# Altium project sar19-main-board.PrjPcb
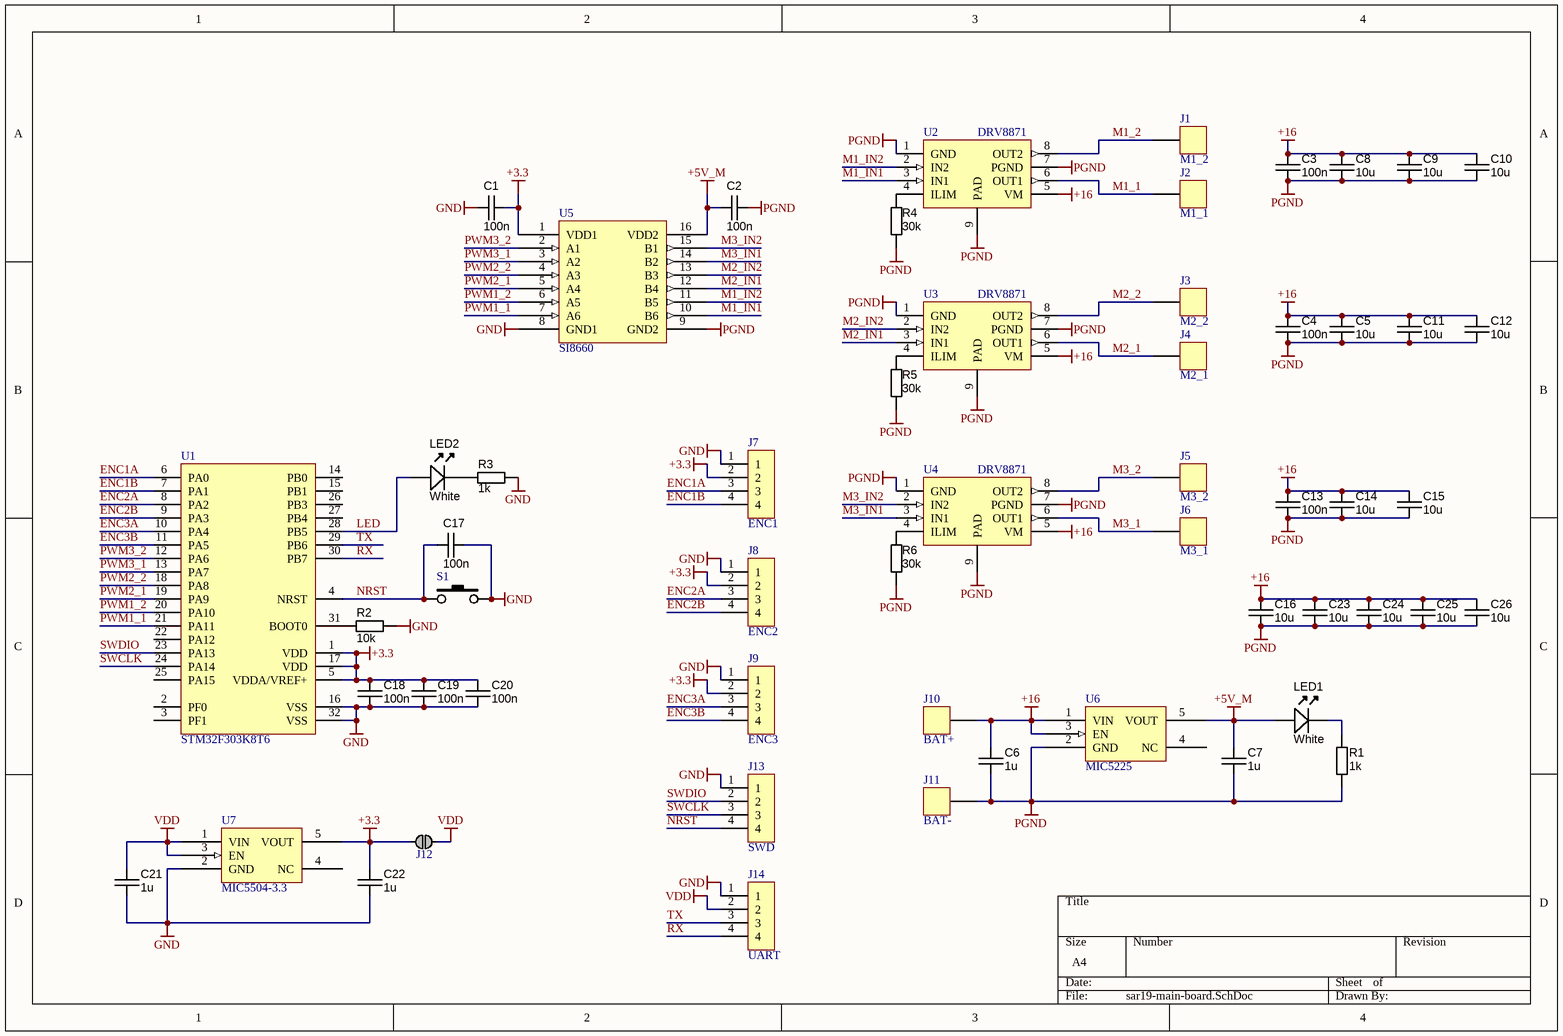
[diagram p0: sar19-main-board.SchDoc]
1 sheet, 56 parts. Net scope: global (net labels, ports and power ports of the same name join across sheets).
Board file: sar19-main-board.PcbDoc

## Sheet sar19-main-board.SchDoc
size A4

### Parts
C1  value 100n  [CAPC1608X90N]  (hidden comment: approved sub OK)
C2  value 100n  [CAPC1608X90N]  (hidden comment: approved sub OK)
C3  value 100n  [CAPC1608X90N]  (hidden comment: approved sub OK)
C4  value 100n  [CAPC1608X90N]  (hidden comment: approved sub OK)
C5  10u  [CAPC3216X180N]
C6  value 1u  [CAPC1608X90N]  (hidden comment: approved sub OK)
C7  value 1u  [CAPC1608X90N]  (hidden comment: approved sub OK)
C8  10u  [CAPC3216X180N]
C9  10u  [CAPC3216X180N]
C10  10u  [CAPC3216X180N]
C11  10u  [CAPC3216X180N]
C12  10u  [CAPC3216X180N]
C13  value 100n  [CAPC1608X90N]  (hidden comment: approved sub OK)
C14  10u  [CAPC3216X180N]
C15  10u  [CAPC3216X180N]
C16  10u  [CAPC3216X180N]
C17  value 100n  [CAPC1608X90N]  (hidden comment: approved sub OK)
C18  value 100n  [CAPC1608X90N]  (hidden comment: approved sub OK)
C19  value 100n  [CAPC1608X90N]  (hidden comment: approved sub OK)
C20  value 100n  [CAPC1608X90N]  (hidden comment: approved sub OK)
C21  value 1u  [CAPC1608X90N]  (hidden comment: approved sub OK)
C22  value 1u  [CAPC1608X90N]  (hidden comment: approved sub OK)
C23  10u  [CAPC3216X180N]
C24  10u  [CAPC3216X180N]
C25  10u  [CAPC3216X180N]
C26  10u  [CAPC3216X180N]
J1  M1_2  [POWER-PAD-4x3]
J2  M1_1  [POWER-PAD-4x3]
J3  M2_2  [POWER-PAD-4x3]
J4  M2_1  [POWER-PAD-4x3]
J5  M3_2  [POWER-PAD-4x3]
J6  M3_1  [POWER-PAD-4x3]
J7  ENC1  [MICRO-MATCH-FOB-04]
J8  ENC2  [MICRO-MATCH-FOB-04]
J9  ENC3  [MICRO-MATCH-FOB-04]
J10  BAT+  [POWER-PAD-4x3]
J11  BAT-  [POWER-PAD-4x3]
J12  JUMPER  [JUMPER-SMD-1010]  (value not drawn)
J13  SWD  [MICRO-MATCH-FOB-04]
J14  UART  [MICRO-MATCH-FOB-04]
LED1  White  [LED-0603-GREEN]
LED2  White  [LED-0603-GREEN]
R1  1k  [RESC1608X55N]
R2  10k  [RESC1608X55N]
R3  1k  [RESC1608X55N]
R4  30k  [RESC1608X55N]
R5  30k  [RESC1608X55N]
R6  30k  [RESC1608X55N]
S1  PUSHBUTTON  [KMR421NGLFS]  (value not drawn)
U1  STM32F303K8T6  [LQFP32]
U2  DRV8871  [HSOP8]
U3  DRV8871  [HSOP8]
U4  DRV8871  [HSOP8]
U5  SI8660  [QSOP16]
U6  MIC5225  [SOT23-5]
U7  MIC5504-3.3  [SOT23-5]

### Nets
+3.3: C1.1 C18.1 C19.1 C20.1 C22.1 J7.2 J8.2 J9.2 J12.1 U1.1(VDD) U1.5(VDDA/VREF+) U1.17(VDD) U5.1(VDD1) U7.5(VOUT)
+5V_M: C2.1 C7.1 LED1.A U5.16(VDD2) U6.5(VOUT)
+16: C3.1 C4.1 C5.1 C6.1 C8.1 C9.1 C10.1 C11.1 C12.1 C13.1 C14.1 C15.1 C16.1 C23.1 C24.1 C25.1 C26.1 J10.1 U2.5(VM) U3.5(VM) U4.5(VM) U6.1(VIN) U6.3(EN)
GND: C1.2 C17.1 C18.2 C19.2 C20.2 C21.2 C22.2 J7.1 J8.1 J9.1 J13.1 J14.1 R2.2 R3.2 S1.2 U1.16(VSS) U1.32(VSS) U5.8(GND1) U7.2(GND)
PGND: C2.2 C3.2 C4.2 C5.2 C6.2 C7.2 C8.2 C9.2 C10.2 C11.2 C12.2 C13.2 C14.2 C15.2 C16.2 C23.2 C24.2 C25.2 C26.2 J11.1 R1.2 R4.2 R5.2 R6.2 U2.1(GND) U2.7(PGND) U2.9(PAD) U3.1(GND) U3.7(PGND) U3.9(PAD) U4.1(GND) U4.7(PGND) U4.9(PAD) U5.9(GND2) U6.2(GND)
VDD: C21.1 J12.2 J14.2 U7.1(VIN) U7.3(EN)
ENC1A: J7.3 U1.6(PA0)
ENC1B: J7.4 U1.7(PA1)
ENC2A: J8.3 U1.8(PA2)
ENC2B: J8.4 U1.9(PA3)
ENC3A: J9.3 U1.10(PA4)
ENC3B: J9.4 U1.11(PA5)
LED: LED2.A U1.28(PB5)
M1_1: J2.1 U2.6(OUT1)
M1_2: J1.1 U2.8(OUT2)
M1_IN1: U2.3(IN1) U5.10(B6)
M1_IN2: U2.2(IN2) U5.11(B5)
M2_1: J4.1 U3.6(OUT1)
M2_2: J3.1 U3.8(OUT2)
M2_IN1: U3.3(IN1) U5.12(B4)
M2_IN2: U3.2(IN2) U5.13(B3)
M3_1: J6.1 U4.6(OUT1)
M3_2: J5.1 U4.8(OUT2)
M3_IN1: U4.3(IN1) U5.14(B2)
M3_IN2: U4.2(IN2) U5.15(B1)
NRST: C17.2 J13.4 S1.1 U1.4(NRST)
PWM1_1: U1.21(PA11) U5.7(A6)
PWM1_2: U1.20(PA10) U5.6(A5)
PWM2_1: U1.19(PA9) U5.5(A4)
PWM2_2: U1.18(PA8) U5.4(A3)
PWM3_1: U1.13(PA7) U5.3(A2)
PWM3_2: U1.12(PA6) U5.2(A1)
RX: J14.4 U1.30(PB7)
SWCLK: J13.3 U1.24(PA14)
SWDIO: J13.2 U1.23(PA13)
TX: J14.3 U1.29(PB6)
NetLED1_K: LED1.K R1.1
NetLED2_K: LED2.K R3.1
NetR2_1: R2.1 U1.31(BOOT0)
NetR4_1: R4.1 U2.4(ILIM)
NetR5_1: R5.1 U3.4(ILIM)
NetR6_1: R6.1 U4.4(ILIM)

Not connected (* = marked no-connect by the designer): U1 2(PF0) 3(PF1) 14(PB0) 15(PB1) 22(PA12) 25(PA15) 26(PB3) 27(PB4); U6 4(NC); U7 4(NC)

### Library data of the parts
C1-C4 C6 C7 C13 C17-C22 = CAPC_100n_0603_X7R_50V_10%: Capacitor SMD Cer 100nF 10% 50V X7R 0603; Manufacturer 1: AVX Corporation; Manufacturer Part Number 1: 06035C104KAT2A; Ratings: 50V; X7R; Material: ceramic; SCDType: spec; Manufacturer 2: TDK Corporation; Manufacturer Part Number 2: C1608X7R1H104K; Package / Case: 0603 (1608 Metric); Tolerance: ±10%; Supplier 1: Digi-Key; Supplier Part Number 1: 478-5052-1-ND; ComponentLink1URL: http://www.avx.com/docs/Catalogs/cx7r.pdf; ComponentLink1Description: http://www.avx.com/docs/Catalogs/cx7r.pdf; Supplier 2: Digi-Key; Supplier Part Number 2: 445-1314-1-ND; ComponentLink2URL: http://product.tdk.com/capacitor/mlcc/en/documents/mlcc_commercial_general_en.pdf; ComponentLink2Description: http://product.tdk.com/capacitor/mlcc/en/documents/mlcc_commercial_general_en.pdf
C5 C8-C12 C14-C16 C23-C26 = CAPC_10u_1206_16V: Capacitor SMD Cer 10uF 10% 16V X7R 1206; Manufacturer 1: Kemet; Manufacturer Part Number 1: C1206C106K4RACTU; Ratings: 16V; X7R; Material: ceramic; SCDType: spec; Value: 10µ; Package / Case: 1206 (3216 metric); Tolerance: ±10%; Supplier 1: Digi-Key; Supplier Part Number 1: 399-3525-1-ND
J1-J6 J10 J11 = HEADER-1
J7-J9 J13 J14 = HEADER-4
J12 = JUMPER-SMD
LED1 LED2 = LED_SMD_Green_0603_570nm: LED 0603 SMD Green 570nm 50mcd 20mA; Manufacturer 1: Kingbright Company LLC; Manufacturer Part Number 1: APT1608CGCK; Material: AlGaInP; Ratings: 20mcd min; 50 mcd typ; 570 nm; Voltage - Forward (Vf) Typ: 2.1V; Viewing Angle: 120°; Lens Style/Size: Rectangle with Flat Top, 1.1mm x 0.8mm; Voltage - Forward (Vf) @ 10mA: 2.0V; SCDType: source; Wavelength - Peak: 574nm; Lens Type: Clear; Package / Case: 0603 (1608 metric); Color: Green; Current - Test: 20mA; Supplier 1: Digi-Key; Supplier Part Number 1: 754-1116-1-ND; RoHS 1: RoHS Compliant; Wavelength - Dominant: 570nm; ComponentLink1URL: http://www.us.kingbright.com/images/catalog/SPEC/APT1608CGCK.pdf; ComponentLink1Description: http://www.us.kingbright.com/images/catalog/SPEC/APT1608CGCK.pdf
R1 R3-R6 = RES_1K_0603_1%: Resistor SMD chip 1k Ohm 0.1W 1% 0603; Manufacturer 1: Yageo; Manufacturer Part Number 1: RC0603FR-071KL; Ratings: 1/10W; SCDType: spec; Package / Case: 0603 (1608 Metric); Supplier 1: Digi-Key; Supplier Part Number 1: 311-1.00KHRCT-ND; Tolerance: ±1%; Value: 1K
R2 = RES_10K_0603_5%: Resistor SMD chip 10k Ohm 0.1W 5% 0603; Manufacturer 1: Yageo; Manufacturer Part Number 1: RC0603JR-0710KL; Ratings: 1/10 W; SCDType: spec; Package / Case: 0603 (1608 metric); Tolerance: ±5%; Material: Thick Film; Supplier 1: Digi-Key; Supplier Part Number 1: 311-10KGRCT-ND; Supplier 2: Digi-Key; Supplier Part Number 2: 541-10KGCT-ND; Manufacturer 2: Vishay Dale; Manufacturer Part Number 2: CRCW060310K0JNEA; ComponentLink2URL: http://www.vishay.com/doc?20035; ComponentLink2Description: http://www.vishay.com/doc?20035; ComponentLink1URL: http://www.yageo.com/documents/recent/PYu-RC0603_51_RoHS_L_4.pdf; ComponentLink1Description: http://www.yageo.com/documents/recent/PYu-RC0603_51_RoHS_L_4.pdf; Value: 10K
U6 U7 = LDO-SOT23-5